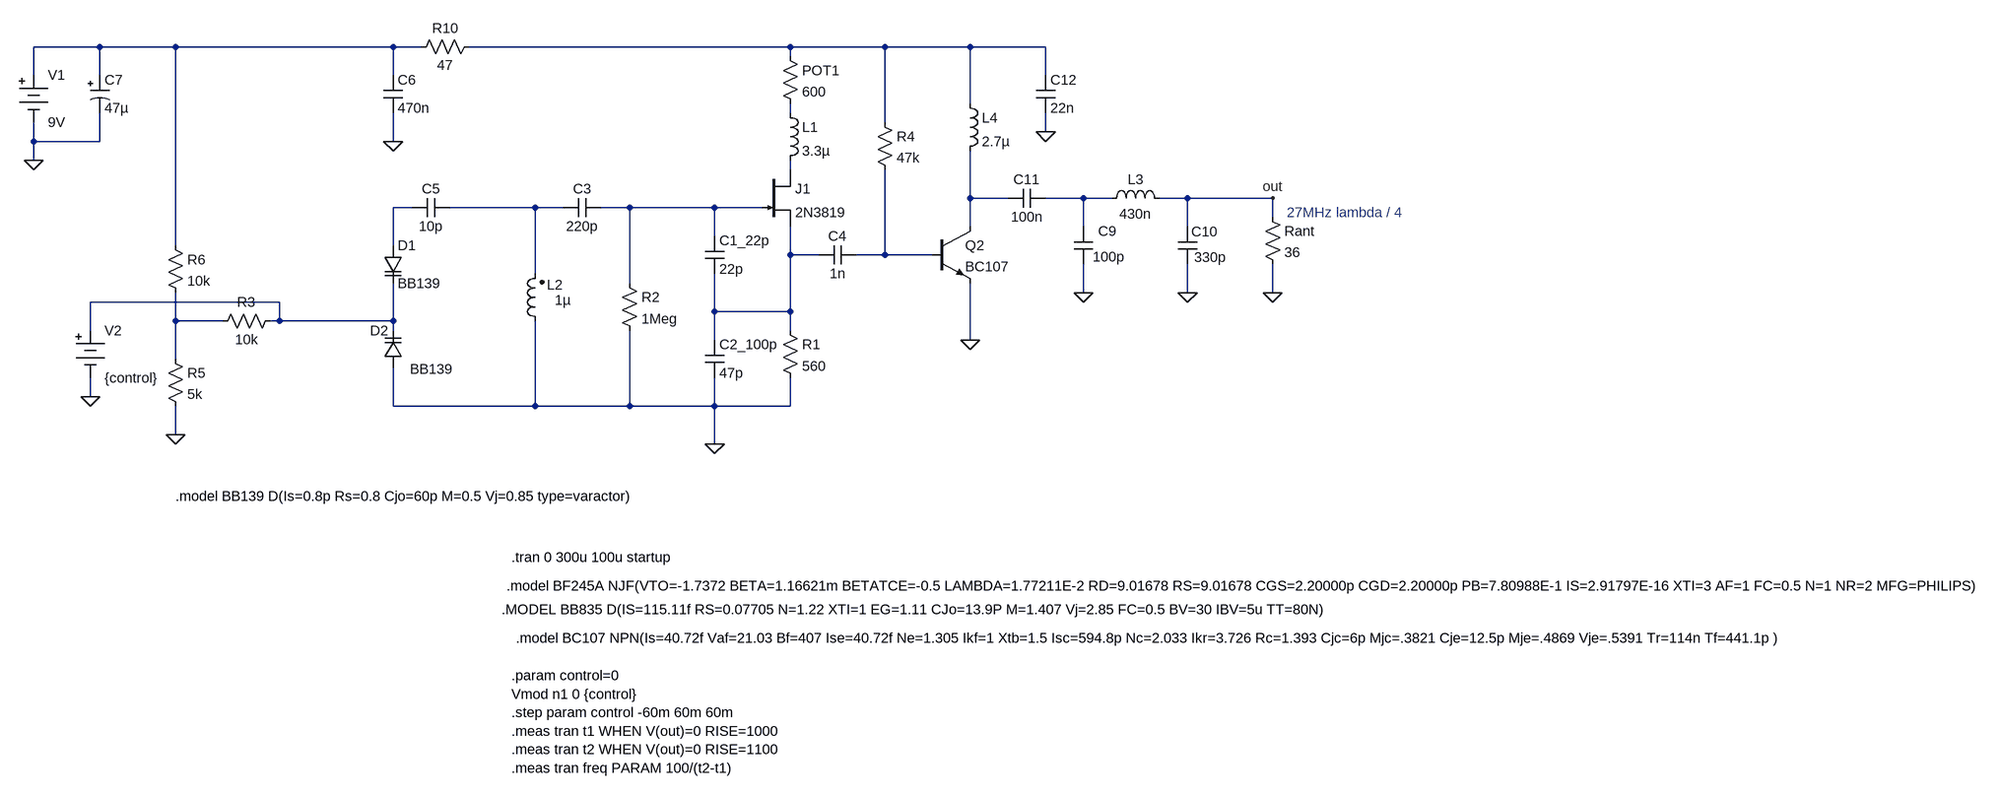
[diagram p0: schematic mini-fm-transmitter.asc]
mini-fm-transmitter.asc, the LTspice schematic file:
Version 4.1
SHEET 1 1176 716
WIRE -2160 -672 -2272 -672
WIRE -2032 -672 -2160 -672
WIRE -1664 -672 -2032 -672
WIRE -1616 -672 -1664 -672
WIRE -992 -672 -1536 -672
WIRE -832 -672 -992 -672
WIRE -688 -672 -832 -672
WIRE -560 -672 -688 -672
WIRE -992 -656 -992 -672
WIRE -2272 -624 -2272 -672
WIRE -2160 -624 -2160 -672
WIRE -1664 -624 -1664 -672
WIRE -560 -624 -560 -672
WIRE -688 -576 -688 -672
WIRE -992 -560 -992 -576
WIRE -832 -544 -832 -672
WIRE -560 -528 -560 -560
WIRE -2272 -512 -2272 -544
WIRE -2160 -512 -2160 -560
WIRE -2160 -512 -2272 -512
WIRE -1664 -512 -1664 -560
WIRE -2272 -480 -2272 -512
WIRE -992 -464 -992 -480
WIRE -688 -416 -688 -496
WIRE -624 -416 -688 -416
WIRE -496 -416 -560 -416
WIRE -448 -416 -496 -416
WIRE -320 -416 -368 -416
WIRE -176 -416 -320 -416
WIRE -1632 -400 -1664 -400
WIRE -1424 -400 -1568 -400
WIRE -1376 -400 -1424 -400
WIRE -1264 -400 -1312 -400
WIRE -1120 -400 -1264 -400
WIRE -1040 -400 -1120 -400
WIRE -176 -384 -176 -416
WIRE -688 -368 -688 -416
WIRE -496 -368 -496 -416
WIRE -320 -368 -320 -416
WIRE -1120 -352 -1120 -400
WIRE -2032 -336 -2032 -672
WIRE -1664 -336 -1664 -400
WIRE -992 -320 -992 -368
WIRE -944 -320 -992 -320
WIRE -832 -320 -832 -464
WIRE -832 -320 -880 -320
WIRE -752 -320 -832 -320
WIRE -1424 -288 -1424 -400
WIRE -1264 -272 -1264 -400
WIRE -496 -256 -496 -304
WIRE -320 -256 -320 -304
WIRE -176 -256 -176 -304
WIRE -1856 -240 -2176 -240
WIRE -1120 -224 -1120 -288
WIRE -992 -224 -992 -320
WIRE -992 -224 -1120 -224
WIRE -2032 -208 -2032 -256
WIRE -1952 -208 -2032 -208
WIRE -1856 -208 -1856 -240
WIRE -1856 -208 -1872 -208
WIRE -1664 -208 -1664 -272
WIRE -1664 -208 -1856 -208
WIRE -2176 -192 -2176 -240
WIRE -1664 -192 -1664 -208
WIRE -992 -192 -992 -224
WIRE -1120 -176 -1120 -224
WIRE -688 -176 -688 -272
WIRE -2032 -144 -2032 -208
WIRE -2176 -80 -2176 -112
WIRE -1664 -64 -1664 -128
WIRE -1424 -64 -1424 -208
WIRE -1424 -64 -1664 -64
WIRE -1264 -64 -1264 -192
WIRE -1264 -64 -1424 -64
WIRE -1120 -64 -1120 -112
WIRE -1120 -64 -1264 -64
WIRE -992 -64 -992 -112
WIRE -992 -64 -1120 -64
WIRE -2032 -16 -2032 -64
WIRE -1120 0 -1120 -64
FLAG -1120 0 0
FLAG -2272 -480 0
FLAG -1664 -512 0
FLAG -688 -176 0
FLAG -496 -256 0
FLAG -320 -256 0
FLAG -176 -256 0
FLAG -560 -528 0
FLAG -176 -416 out
FLAG -2032 -16 0
FLAG -2176 -80 0
DATAFLAG -176 -432 ""
SYMBOL cap -1136 -352 R0
SYMATTR InstName C1_22p
SYMATTR Value 22p
SYMBOL cap -1136 -176 R0
SYMATTR InstName C2_100p
SYMATTR Value 47p
SYMBOL res -1008 -208 R0
SYMATTR InstName R1
SYMATTR Value 560
SYMBOL Misc\\battery -2272 -640 R0
SYMATTR InstName V1
SYMATTR Value 9V
SYMBOL ind2 -1408 -192 R180
WINDOW 0 -31 77 Left 2
WINDOW 3 -45 51 Left 2
SYMATTR InstName L2
SYMATTR Value 1µ
SYMATTR SpiceLine Rser=9
SYMBOL njf -1040 -464 R0
SYMATTR InstName J1
SYMATTR Value 2N3819
SYMBOL res -1280 -288 R0
SYMATTR InstName R2
SYMATTR Value 1Meg
SYMBOL res -1008 -672 R0
SYMATTR InstName POT1
SYMATTR Value 600
SYMBOL cap -1376 -384 R270
WINDOW 0 32 32 VTop 2
WINDOW 3 0 32 VBottom 2
SYMATTR InstName C3
SYMATTR Value 220p
SYMBOL cap -944 -304 R270
WINDOW 0 32 32 VTop 2
WINDOW 3 0 32 VBottom 2
SYMATTR InstName C4
SYMATTR Value 1n
SYMBOL varactor -1648 -128 R180
WINDOW 0 24 64 Left 2
WINDOW 3 -85 -1 Left 2
SYMATTR InstName D2
SYMATTR Value BB139
SYMATTR Type diode
SYMBOL cap -1680 -624 R0
SYMATTR InstName C6
SYMATTR Value 470n
SYMBOL res -1632 -656 R270
WINDOW 0 32 56 VTop 2
WINDOW 3 0 56 VBottom 2
SYMATTR InstName R10
SYMATTR Value 47
SYMBOL polcap -2176 -624 R0
SYMATTR InstName C7
SYMATTR Value 47µ
SYMBOL ind -1008 -576 R0
SYMATTR InstName L1
SYMATTR Value 3.3µ
SYMBOL cap -480 -304 R180
WINDOW 0 -40 56 Left 2
WINDOW 3 -54 13 Left 2
SYMATTR InstName C9
SYMATTR Value 100p
SYMBOL cap -304 -304 R180
WINDOW 0 -35 55 Left 2
WINDOW 3 -49 12 Left 2
SYMATTR InstName C10
SYMATTR Value 330p
SYMBOL ind -464 -400 R270
WINDOW 0 32 56 VTop 2
WINDOW 3 5 56 VBottom 2
SYMATTR InstName L3
SYMATTR Value 430n
SYMATTR SpiceLine Rser=1m
SYMBOL res -192 -400 R0
SYMATTR InstName Rant
SYMATTR Value 36
SYMBOL ind -704 -592 R0
SYMATTR InstName L4
SYMATTR Value 2.7µ
SYMATTR SpiceLine Rser=10m
SYMBOL cap -560 -432 R90
WINDOW 0 0 32 VBottom 2
WINDOW 3 32 32 VTop 2
SYMATTR InstName C11
SYMATTR Value 100n
SYMBOL npn -752 -368 R0
SYMATTR InstName Q2
SYMATTR Value BC107
SYMBOL res -848 -560 R0
SYMATTR InstName R4
SYMATTR Value 47k
SYMBOL cap -576 -624 R0
SYMATTR InstName C12
SYMATTR Value 22n
SYMBOL res -1968 -192 R270
WINDOW 0 32 56 VTop 2
WINDOW 3 0 56 VBottom 2
SYMATTR InstName R3
SYMATTR Value 10k
SYMBOL cap -1632 -384 R270
WINDOW 0 32 32 VTop 2
WINDOW 3 0 32 VBottom 2
SYMATTR InstName C5
SYMATTR Value 10p
SYMBOL res -2048 -352 R0
SYMATTR InstName R6
SYMATTR Value 10k
SYMBOL res -2048 -160 R0
SYMATTR InstName R5
SYMATTR Value 5k
SYMBOL varactor -1680 -336 R0
SYMATTR InstName D1
SYMATTR Value BB139
SYMATTR Type diode
SYMBOL Misc\\battery -2176 -208 R0
SYMATTR InstName V2
SYMATTR Value {control}
TEXT -1464 192 Left 2 !.tran 0 300u 100u startup
TEXT -1472 240 Left 2 !.model BF245A NJF(VTO=-1.7372 BETA=1.16621m BETATCE=-0.5 LAMBDA=1.77211E-2 RD=9.01678 RS=9.01678 CGS=2.20000p CGD=2.20000p PB=7.80988E-1 IS=2.91797E-16 XTI=3 AF=1 FC=0.5 N=1 NR=2 MFG=PHILIPS)
TEXT -1480 280 Left 2 !.MODEL BB835 D(IS=115.11f RS=0.07705 N=1.22 XTI=1 EG=1.11 CJo=13.9P M=1.407 Vj=2.85 FC=0.5 BV=30 IBV=5u TT=80N)
TEXT -152 -392 Left 2 ;27MHz lambda / 4
TEXT -1456 328 Left 2 !.model BC107 NPN(Is=40.72f Vaf=21.03 Bf=407 Ise=40.72f Ne=1.305 Ikf=1 Xtb=1.5 Isc=594.8p Nc=2.033 Ikr=3.726 Rc=1.393 Cjc=6p Mjc=.3821 Cje=12.5p Mje=.4869 Vje=.5391 Tr=114n Tf=441.1p )
TEXT -1464 392 Left 2 !.param control=0\nVmod n1 0 {control}\n.step param control -60m 60m 60m\n.meas tran t1 WHEN V(out)=0 RISE=1000\n.meas tran t2 WHEN V(out)=0 RISE=1100\n.meas tran freq PARAM 100/(t2-t1)
TEXT -2032 88 Left 2 !.model BB139 D(Is=0.8p Rs=0.8 Cjo=60p M=0.5 Vj=0.85 type=varactor)

The netlist it stands for:
* mini-fm-transmitter.asc
C1_22p N009 N010 22p
C2_100p N010 0 47p
R1 N010 0 560
V1 N001 0 9V
L2 0 N008 1µ Rser=9
J1 N004 N009 N010 2N3819
R2 N009 0 1Meg
R§POT1 N002 N003 600
C3 N008 N009 220p
C4 N010 N011 1n
D2 0 N012 BB139
C6 N001 0 470n
R10 N001 N002 47
C7 N001 0 47µ
L1 N003 N004 3.3µ
C9 0 N006 100p
C10 0 out 330p
L3 N006 out 430n Rser=1m
Rant out 0 36
L4 N002 N005 2.7µ Rser=10m
C11 N006 N005 100n
Q2 N005 N011 0 0 BC107
R4 N002 N011 47k
C12 N002 0 22n
R3 N013 N012 10k
C5 N007 N008 10p
R6 N001 N013 10k
R5 N013 0 5k
D1 N007 N012 BB139
V2 N012 0 {control}
.model D D
.lib standard.dio
.model NPN NPN
.model PNP PNP
.lib standard.bjt
.model NJF NJF
.model PJF PJF
.lib standard.jft
.tran 0 300u 100u startup
.model BF245A NJF(VTO=-1.7372 BETA=1.16621m BETATCE=-0.5 LAMBDA=1.77211E-2 RD=9.01678 RS=9.01678 CGS=2.20000p CGD=2.20000p PB=7.80988E-1 IS=2.91797E-16 XTI=3 AF=1 FC=0.5 N=1 NR=2 MFG=PHILIPS)
.MODEL BB835 D(IS=115.11f RS=0.07705 N=1.22 XTI=1 EG=1.11 CJo=13.9P M=1.407 Vj=2.85 FC=0.5 BV=30 IBV=5u TT=80N)
* 27MHz lambda / 4
.model BC107 NPN(Is=40.72f Vaf=21.03 Bf=407 Ise=40.72f Ne=1.305 Ikf=1 Xtb=1.5 Isc=594.8p Nc=2.033 Ikr=3.726 Rc=1.393 Cjc=6p Mjc=.3821 Cje=12.5p Mje=.4869 Vje=.5391 Tr=114n Tf=441.1p )
.param control=0
Vmod n1 0 {control}
.step param control -60m 60m 60m
.meas tran t1 WHEN V(out)=0 RISE=1000
.meas tran t2 WHEN V(out)=0 RISE=1100
.meas tran freq PARAM 100/(t2-t1)
.model BB139 D(Is=0.8p Rs=0.8 Cjo=60p M=0.5 Vj=0.85 type=varactor)
.backanno
.end